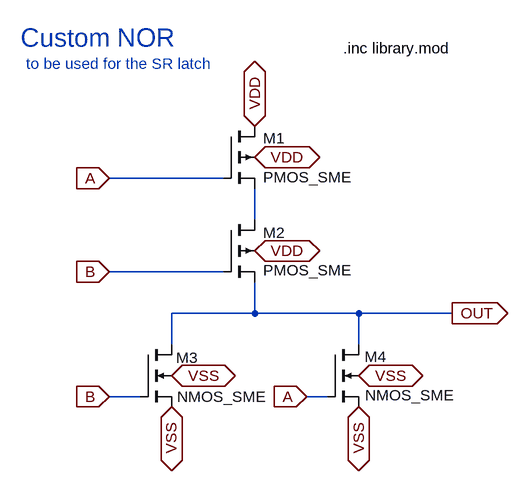
[diagram p0: schematic my_nor.asc]
my_nor.asc, the LTspice schematic file:
Version 4.1
SHEET 1 880 780
WIRE 256 240 80 240
WIRE 304 304 304 256
WIRE 256 384 80 384
WIRE 304 448 304 400
WIRE 304 448 176 448
WIRE 464 448 304 448
WIRE 608 448 464 448
WIRE 176 496 176 448
WIRE 464 496 464 448
WIRE 128 576 80 576
WIRE 416 576 384 576
FLAG 80 240 A
IOPIN 80 240 In
FLAG 80 384 B
IOPIN 80 384 In
FLAG 608 448 OUT
IOPIN 608 448 Out
FLAG 176 592 VSS
IOPIN 176 592 BiDir
FLAG 464 592 VSS
IOPIN 464 592 BiDir
FLAG 464 544 VSS
IOPIN 464 544 BiDir
FLAG 176 544 VSS
IOPIN 176 544 BiDir
FLAG 304 160 VDD
IOPIN 304 160 BiDir
FLAG 304 208 VDD
IOPIN 304 208 BiDir
FLAG 304 352 VDD
IOPIN 304 352 BiDir
FLAG 80 576 B
IOPIN 80 576 In
FLAG 384 576 A
IOPIN 384 576 In
SYMBOL pmos4 256 160 R0
WINDOW 0 61 19 Left 2
WINDOW 3 61 79 Left 2
SYMATTR InstName M1
SYMATTR Value PMOS_SME
SYMATTR Value2 l=0.35u w=0.4u
SYMBOL pmos4 256 304 R0
WINDOW 0 61 20 Left 2
WINDOW 3 61 78 Left 2
SYMATTR InstName M2
SYMATTR Value PMOS_SME
SYMATTR Value2 l=0.35u w=0.4u
SYMBOL nmos4 128 496 R0
WINDOW 0 55 20 Left 2
WINDOW 3 57 80 Left 2
SYMATTR InstName M3
SYMATTR Value NMOS_SME
SYMATTR Value2 l=0.35u w=0.4u
SYMBOL nmos4 416 496 R0
WINDOW 0 57 19 Left 2
WINDOW 3 58 78 Left 2
SYMATTR InstName M4
SYMATTR Value NMOS_SME
SYMATTR Value2 l=0.35u w=0.4u
TEXT -56 24 Left 4 ;Custom NOR
TEXT 440 40 Left 2 !.inc library.mod
TEXT -48 64 Left 2 ;to be used for the SR latch

The netlist it stands for:
* my_nor.asc
M1 VDD A N001 VDD PMOS_SME l=0.35u w=0.4u
M2 N001 B OUT VDD PMOS_SME l=0.35u w=0.4u
M3 OUT B VSS VSS NMOS_SME l=0.35u w=0.4u
M4 OUT A VSS VSS NMOS_SME l=0.35u w=0.4u
.model NMOS NMOS
.model PMOS PMOS
.lib standard.mos
* Custom NOR
.inc library.mod
* to be used for the SR latch
.backanno
.end